# Altium schematic sheet MAPLE_CDH_SCH.SchDoc
size A4; SheetNumber: 1; SheetTotal: 2
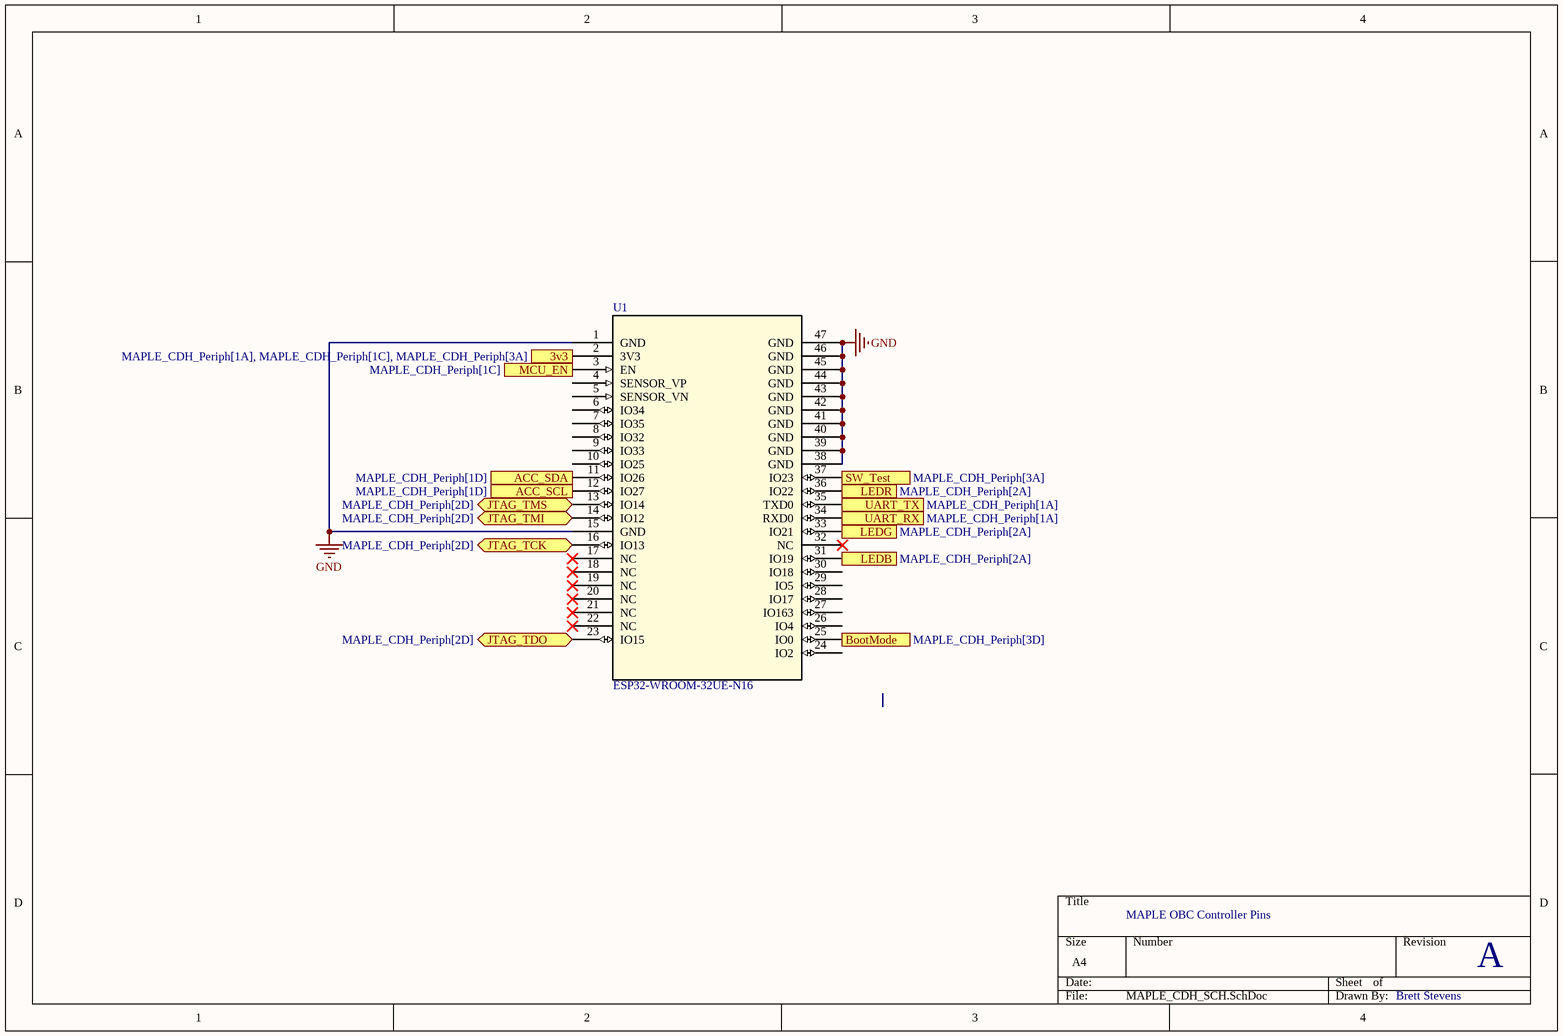
[diagram p0: MAPLE_CDH_SCH.SchDoc]

## Parts
U1  ESP32-WROOM-32UE-N16  [ESP32-32UE_EXP]

## Ports
3v3 (in, see MAPLE_CDH_Periph[1A], MAPLE_CDH_Periph[1C], MAPLE_CDH_Periph[3A]), ACC_SCL (in, see MAPLE_CDH_Periph[1D]), ACC_SDA (in, see MAPLE_CDH_Periph[1D]), BootMode (in, see MAPLE_CDH_Periph[3D]), JTAG_TCK (bidir, see MAPLE_CDH_Periph[2D]), JTAG_TDO (bidir, see MAPLE_CDH_Periph[2D]), JTAG_TMI (bidir, see MAPLE_CDH_Periph[2D]), JTAG_TMS (bidir, see MAPLE_CDH_Periph[2D]), LEDB (out, see MAPLE_CDH_Periph[2A]), LEDG (out, see MAPLE_CDH_Periph[2A]), LEDR (out, see MAPLE_CDH_Periph[2A]), MCU_EN (in, see MAPLE_CDH_Periph[1C]), SW_Test (in, see MAPLE_CDH_Periph[3A]), UART_RX (in, see MAPLE_CDH_Periph[1A]), UART_TX (out, see MAPLE_CDH_Periph[1A])

## Nets
GND: U1.1(GND) U1.15(GND) U1.38(GND) U1.39(GND) U1.40(GND) U1.41(GND) U1.42(GND) U1.43(GND) U1.44(GND) U1.45(GND) U1.46(GND) U1.47(GND)
3v3: U1.2(3V3) ; port 3v3
ACC_SCL: U1.12(IO27) ; port ACC_SCL
ACC_SDA: U1.11(IO26) ; port ACC_SDA
BootMode: U1.25(IO0) ; port BootMode
JTAG_TCK: U1.16(IO13) ; port JTAG_TCK
JTAG_TDO: U1.23(IO15) ; port JTAG_TDO
JTAG_TMI: U1.14(IO12) ; port JTAG_TMI
JTAG_TMS: U1.13(IO14) ; port JTAG_TMS
LEDB: U1.31(IO19) ; port LEDB
LEDG: U1.33(IO21) ; port LEDG
LEDR: U1.36(IO22) ; port LEDR
MCU_EN: U1.3(EN) ; port MCU_EN
SW_Test: U1.37(IO23) ; port SW_Test
UART_RX: U1.34(RXD0) ; port UART_RX
UART_TX: U1.35(TXD0) ; port UART_TX

Not connected (* = marked no-connect by the designer): U1 4(SENSOR_VP) 5(SENSOR_VN) 6(IO34) 7(IO35) 8(IO32) 9(IO33) 10(IO25) 17(NC)* 18(NC)* 19(NC)* 20(NC)* 21(NC)* 22(NC)* 24(IO2) 26(IO4) 27(IO163) 28(IO17) 29(IO5) 30(IO18) 32(NC)*

## Notes on the sheet
- MAPLE OBC Controller Pins
- A
- Brett Stevens

## Library data of the parts
U1 = ESP32-WROOM-32UE-N16: No Description Available; Mfr_Name: Espressif Systems; Type: DEV; Copyright: Copyright (C) 2023 Ultra Librarian. All rights reserved.; Manufacturer_Part_Number: ESP32-WROOM-32UE-N16; RefDes: RefDes